# Altium schematic sheet Power.SchDoc: Power
size A4; ApprovedBy: Eli; CheckedBy: Eli; DrawnBy: Eli; Engineer: Eli; Organization: 富源盛电子科技有限公司; Address1: 深圳市龙华新区; Address2: 观澜街道科利邦工业园; Address3: B栋（宿舍楼）15楼; Address4: T: 159 8944 7740; DocumentNumber: 4; Revision: 1.0; SheetNumber: 4; SheetTotal: 8; Status: Final
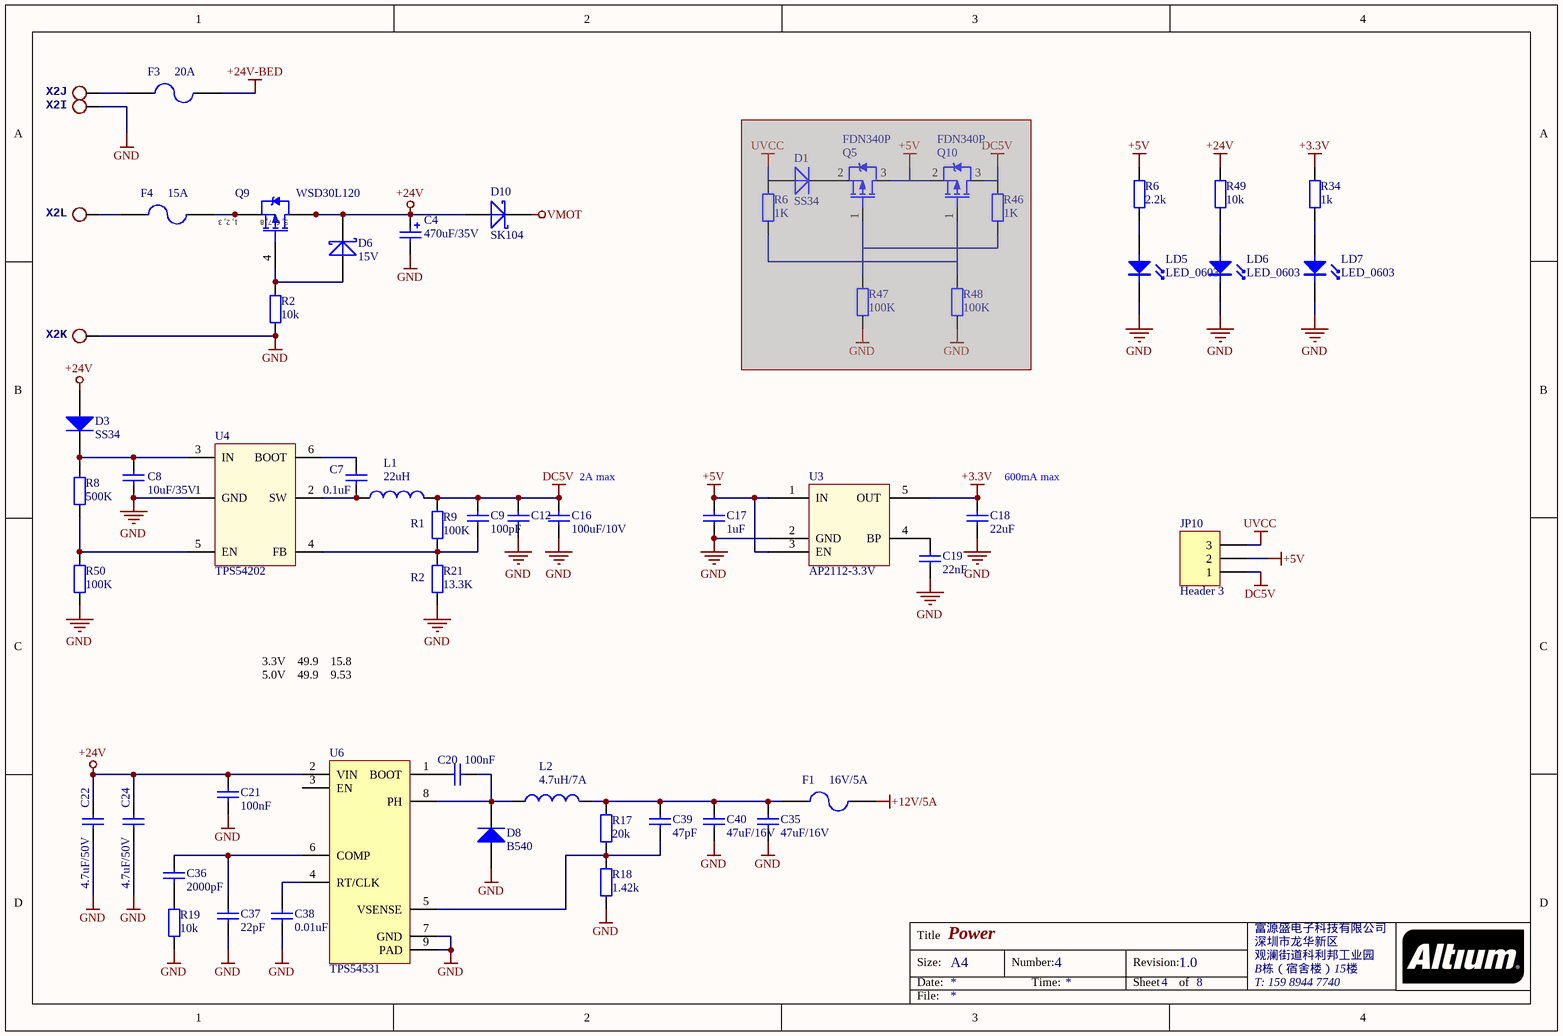
[diagram p0: Power.SchDoc]

## Parts
(Parts that share a designator on the sheet are numbered #1, #2 ... from top to bottom, then left to right.)
C4  470uF/35V  [RCL_E5-10,5 - 1/2]
C7  0.1uF  [CAP0402]
C8  10uF/35V  [CAP1206]
C9  100pF  [CAP0402]
C12  100uF/10V  [CAP1206]  (value not drawn)
C16  100uF/10V  [CAP1206]
C17  1uF  [CAP0603]
C18  22uF  [CAP0805]
C19  22nF  [CAP0603]
C20  100nF  [CAP0603]
C21  100nF  [CAP0603]
C22  4.7uF/50V  [CAP1206]
C24  4.7uF/50V  [CAP1206]
C35  47uF/16V  [CAP1206]
C36  2000pF  [CAP0603]
C37  22pF  [CAP0603]
C38  0.01uF  [CAP0603]
C39  47pF  [CAP0603]
C40  47uF/16V  [CAP1206]
D1  SS34  [SOD123]  (masked out: inside a compile mask, not in the netlist)
D3  SS34  [DO214AC (SMA)]
D6  15V  [SOD123]
D8  B540  [SMC/DO-214AB]
D10  SK104  [POWEREDI5]
F1  16V/5A  [RES1206]
F3  20A  [Fuse_Holder_TH_3568]
F4  15A  [Fuse_Holder_TH_3568]
JP10  Header 3  [Header 1X3]
L1  22uH  [NRS6045]
L2  4.7uH/7A  [10X10屏蔽电感 5A]
LD5  LED_0603  [LED0603]
LD6  LED_0603  [LED0603]
LD7  LED_0603  [LED0603]
Q5  FDN340P  [SOT23-3]  (masked out: inside a compile mask, not in the netlist)
Q9  WSD30L120  [AO_DFN5x6]
Q10  FDN340P  [SOT23-3]  (masked out: inside a compile mask, not in the netlist)
R2  10k  [RES0603]
R6#1  2.2k  [RES0402]
R6#2  1K  [RES0402]  (masked out: inside a compile mask, not in the netlist)
R8  500K  [RES0402]
R9  100K  [RES0402]
R17  20k  [RES0603]
R18  1.42k  [RES0603]
R19  10k  [RES0603]
R21  13.3K  [RES0402]
R34  1k  [RES0402]
R46  1K  [RES0402]  (masked out: inside a compile mask, not in the netlist)
R47  100K  [RES0402]  (masked out: inside a compile mask, not in the netlist)
R48  100K  [RES0402]  (masked out: inside a compile mask, not in the netlist)
R49  10k  [RES0402]
R50  100K  [RES0402]
U3  AP2112-3.3V  [SOT23-5]
U4  TPS54202  [SOT23-6N]
U6  TPS54531  [SO8_WITH PAD]
X2  5.08-12P  [CON-PHOENIX-508_MKDSN1,5/12-5,08]  (value not drawn)  (parts I,J,K,L of 12)

## Nets
+3.3V: C18.2 R34.2 U3.5(OUT)
+5V: C17.2 JP10.2 R6#1.2 U3.1(IN) U3.3(EN)
+12V/5A: F1.2
+24V: C4.1 C21.2 C22.1 C24.1 D3.1(A) D6.2(K) D10.1(A) Q9.5(D) Q9.6(D) Q9.7(D) Q9.8(D) R49.2 U6.2(VIN)
+24V-BED: F3.2
DC5V: C9.1 C12.1 C16.1 JP10.1 L1.2 R9.1
GND: C4.2 C8.1 C12.2 C16.2 C17.1 C18.1 C19.1 C21.1 C22.2 C24.2 C35.2 C37.1 C38.1 C40.2 D8.1(A) LD5.1(A) LD6.1(A) LD7.1(A) R2.2 R18.2 R19.2 R21.2 R50.1 U3.2(GND) U4.1(GND) U6.7(GND) U6.9(PAD) X2.9(KL) X2.11(KL)
UVCC: JP10.3
VMOT: D10.2(K)
NetC7_1: C7.1 U4.6(BOOT)
NetC7_2: C7.2 L1.1 U4.2(SW)
NetC8_2: C8.2 D3.2(K) R8.2 U4.3(IN)
NetC9_2: C9.2 R9.2 R21.1 U4.4(FB)
NetC19_2: C19.2 U3.4(BP)
NetC20_1: C20.1 D8.2(K) L2.1 U6.8(PH)
NetC20_2: C20.2 U6.1(BOOT)
NetC35_1: C35.1 C39.1 C40.1 F1.1 L2.2 R17.1
NetC36_1: C36.1 R19.1
NetC36_2: C36.2 C37.2 U6.6(COMP)
NetC38_2: C38.2 U6.4(RT/CLK)
NetC39_2: C39.2 R17.2 R18.1 U6.5(VSENSE)
NetD6_1: D6.1(A) Q9.4(G) R2.1
NetF3_1: F3.1 X2.10(KL)
NetF4_1: F4.1 X2.12(KL)
NetF4_2: F4.2 Q9.1(S) Q9.2(S) Q9.3(S)
NetLD5_2: LD5.2(K) R6#1.1
NetLD6_2: LD6.2(K) R49.1
NetLD7_2: LD7.2(K) R34.1
NetR8_1: R8.1 R50.2 U4.5(EN)

Not connected (* = marked no-connect by the designer): U6 3(EN)

## Notes on the sheet
- (near C16) 2A max
- (near C18) 600mA max
- R1
- (near R21) R2
- 3.3V    49.9    15.8
  5.0V    49.9    9.53
- Title
- Size:
- Date:
- A4
- Number:
- Time:
- Revision:
- Sheet
- of
- File:
- (in symbol SI7157DP) 1, 2, 3; 5, 6, 7, 8

## Library data of the parts
C4 = Library_CAP-0004: RO ELCO 100uF 20% 35V CASE-D EEEFP PAN; Faber ItemCode: 36865800; ID: Library_CAP-0004
C7 C17-C19 = Library_CAP-0008: RO C0G 22pF 2% 50V  0603; Faber ItemCode: 35321100; Value: 100nF; ID: Library_CAP-0008
C8 = Capacitor
C9 = Library_CAP-0008: RO C0G 22pF 2% 50V  0603; Faber ItemCode: 35321100; Value: 47pF; ID: Library_CAP-0008
C12 C16 = Library_CAP-0008: RO C0G 22pF 2% 50V  0603; Faber ItemCode: 35321100; Value: 47uF; ID: Library_CAP-0008
C20-C22 C24 C35-C40 = Library_CAP-0008: RO C0G 22pF 2% 50V  0603; Faber ItemCode: 35321100; ID: Library_CAP-0008
  C20 C21: Value: 100nF
  C22 C24: Value: 4.7uF/50V
  C35 C40: Value: 47uF/16V
  C36: Value: 2000pF
  C37: Value: 22pF
  C38: Value: 0.01uF
  C39: Value: 47pF
D1 = Diode_1: RO DIODE S1G DO-214AC; ID: Library_DIO-0001; Faber ItemCode: 32284000; Info: Fast Rectifiers 1A 400V; Value: SS34
D3 D8 = Diode: Default Diode; Published: 8-Jun-2000; LatestRevisionDate: 17-Jul-2002; LatestRevisionNote: Re-released for DXP Platform.; PackageVersion: Sep-1996; PackageReference: SMC; Publisher: Altium Limited; PackageDescription: DO-214-AB/SMC; 2 C-Bend Leads; Body 7.9 x 5.9 mm, inc. leads (LxW); Code_JEDEC: DO-214-AB
D6 D10 = Schottky: RO DIODE SSB44-E3/52T SMB VISHAY; ID: Library_DIO-0003; Info: High-Current Density Surface Mount Schottky Rectifier; Faber ItemCode: 36925500; Mfg: VISHAY; Mfg code: SSB44-E3/52T; Value: SSB44-E3/52T
F1 F3 F4 = Fuse 2: Fuse; Published: 8-Jun-2000; LatestRevisionDate: 17-Jul-2002; LatestRevisionNote: Re-released for DXP Platform.; PackageReference: PIN-W2/E2.8; Publisher: Altium Limited; PackageDescription: Thru-Hole; 2 Leads
JP10 = Header 3: Header, 3-Pin; LatestRevisionDate: 17-Jul-2002; LatestRevisionNote: Re-released for DXP Platform.; Publisher: Altium Limited
L1 L2 = Inductor: Code_IEC: 1005; Published: 8-Jun-2000; LatestRevisionDate: 29-May-2009; LatestRevisionNote: IPC-7351 Footprint Added.; PackageReference: 0402-A; Publisher: Altium Limited; PackageDescription: Chip Inductor; Code_JEITA: 0402
  L1: Value: 22uH
  L2: Value: 4.7uH/7A
Q9 = SI7157DP: PFET Power SO8; Manufacturer: Vishay; Vds: 20V; Vgss: 12V; Id: 60A; OrderingCode: SI7157DP-T1-GE3; Temp_ Max: 150; Temp_ Min: -55; Part Number: SI7157DP; Price (€): 0,605
R2 R17-R19 = Library_RES-0001: RO RES 10k0 1% 0,063W  0603; Faber ItemCode: 36084500; ID: Library_RES-0001; Info: Resistor
  R2 R19: Value: 10k
  R17: Value: 20k
  R18: Value: 1.42k
R6#1 R34 R49 = Library_RES-0004: RO RES 1k0 1% 0,1W  0603; Faber ItemCode: 34637900; ID: Library_RES-0004; Info: Resistor
  R6#1: Value: 2.2k
  R34: Value: 1k
  R49: Value: 10k
R6#2 R46-R48 = Library_RES-0007: RO RES 22E0 1% 0,063W 0603; Faber ItemCode: 36108300; ID: Library_RES-0007; Info: Resistor
  R6#2 R46: Value: 1K
  R47 R48: Value: 100K
R8 R50 = Resistor
R9 = Library_RES-0001: RO RES 10k0 1% 0,063W  0603; Faber ItemCode: 36084500; Value: 49.9k; ID: Library_RES-0001; Info: Resistor
R21 = Library_RES-0001: RO RES 10k0 1% 0,063W  0603; Faber ItemCode: 36084500; Value: 9.53k; ID: Library_RES-0001; Info: Resistor
U3 = RT9193-XXXX
X2 = CON-PHOENIX-508_MKDSN1,5/12-5,08: MPN: SMKDSN1,5/10-5,08; OC_FARNELL: 1792913; OC_NEWARK: 70R0297